# Altium project espressomaker2000.PrjPcb
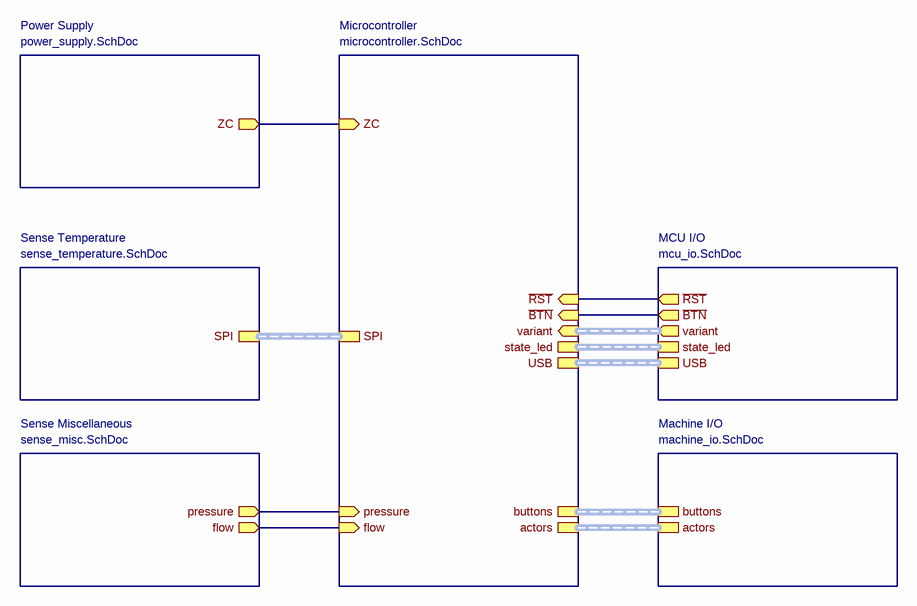
[diagram p0: top_schematic.SchDoc]
ProductNumber: 2001ES; ProductTitle: espressomaster2000; ProjectName: espressomaster2000; Revision: 1
8 sheets, 182 parts. Net scope: hierarchical (ports join the sheet entries above them; power ports are global).
Board file: espressomaster2000.PcbDoc
Sheets:
  top_schematic.SchDoc
    Power Supply = power_supply.SchDoc
    Microcontroller = microcontroller.SchDoc
    Sense Temperature = sense_temperature.SchDoc
      FLT1 = temp_filt.SchDoc
      FLT2 = temp_filt.SchDoc
      FLT3 = temp_filt.SchDoc
      FLT4 = temp_filt.SchDoc
      FLT5 = temp_filt.SchDoc
    Sense Miscellaneous = sense_misc.SchDoc
    Machine I/O = machine_io.SchDoc
    MCU I/O = mcu_io.SchDoc

## Sheet top_schematic.SchDoc: Top Schematic
size A4; Date: 27.05.2014; Author: Stefan Lüthi; Organization: BFH; Address1: Bern University of Applied Sciences; Address2: Engineering and Information Technology; Address3: Jlcoweg 1; Address4: CH-3400 Burgdorf; DocumentNumber: 1; Revision: 1.0; SheetNumber: 1; SheetTotal: 8; CurrentDate: 27.05.2014

### Sub-sheets
Machine I/O = machine_io.SchDoc: buttons (harness buttons), actors (harness actors)
MCU I/O = mcu_io.SchDoc: USB (harness USB), ~{RST} (out), ~{BTN} (out), state_led (harness state_led), variant (out, harness variant)
Microcontroller = microcontroller.SchDoc: actors (harness actors), USB (harness USB), flow (in), ~{RST} (in), pressure (in), ZC (in), SPI (harness SPI), state_led (harness state_led), ~{BTN} (in), buttons (harness buttons), variant (in, harness variant)
Power Supply = power_supply.SchDoc: ZC (out)
Sense Miscellaneous = sense_misc.SchDoc: pressure (out), flow (out)
Sense Temperature = sense_temperature.SchDoc: SPI (harness SPI)

### Nets
~{btn}: sheet Microcontroller/~{BTN}, sheet MCU I/O/~{BTN}
~{RST}: sheet Microcontroller/~{RST}, sheet MCU I/O/~{RST}
flow: sheet Microcontroller/flow, sheet Sense Miscellaneous/flow
pressure: sheet Microcontroller/pressure, sheet Sense Miscellaneous/pressure
zc: sheet Power Supply/ZC, sheet Microcontroller/ZC

### Buses and harness runs
harness sheet Machine I/O/actors = sheet Microcontroller/actors
harness sheet Machine I/O/buttons = sheet Microcontroller/buttons
harness sheet MCU I/O/state_led = sheet Microcontroller/state_led
harness sheet MCU I/O/USB = sheet Microcontroller/USB
harness sheet MCU I/O/variant = sheet Microcontroller/variant
harness sheet Microcontroller/SPI = sheet Sense Temperature/SPI

### Notes on the sheet
- Author:
- Title:
- Number:
- Product:
- Sheet
- of
- Variant:
- Revision:
- File:
- Template:
- A4SL CC-BY-SA (07-17)

## Sheet power_supply.SchDoc: Power Supply
size A4; Date: 27.05.2014; Author: Stefan Lüthi; DrawnBy: Stefan Lüthi; Organization: BFH; Address1: Bern University of Applied Sciences; Address2: Engineering and Information Technology; Address3: Jlcoweg 1; Address4: CH-3400 Burgdorf; DocumentNumber: 1; Revision: 1.0; SheetNumber: 2; SheetTotal: 8; CurrentDate: 27.05.2014
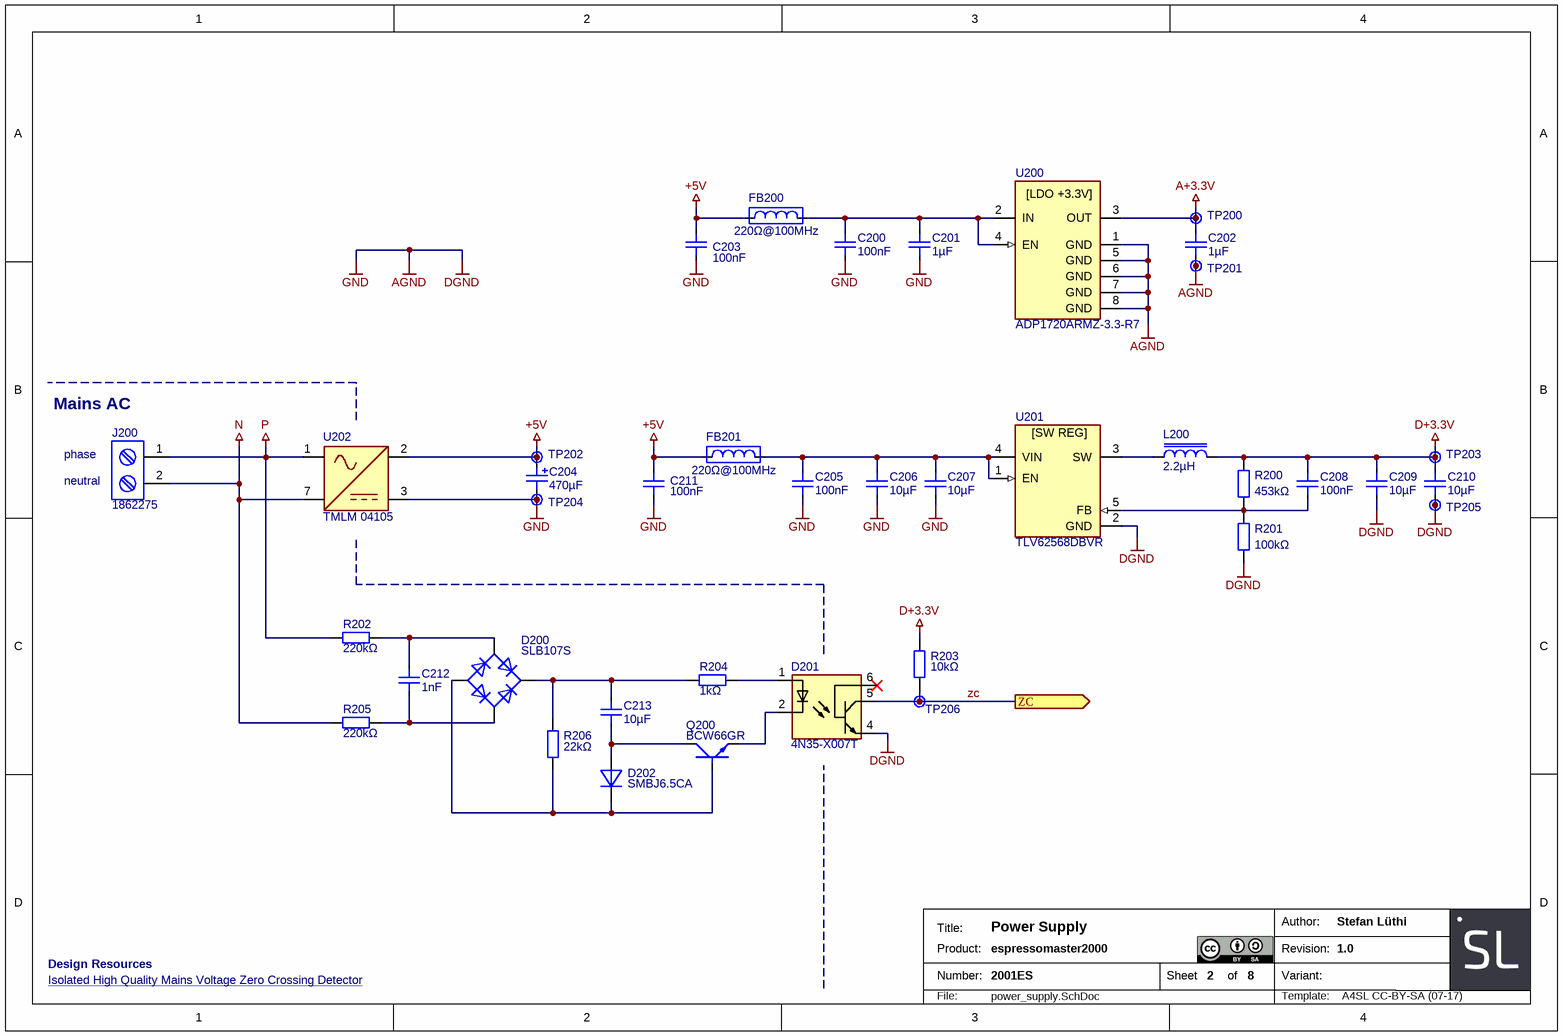
[diagram p1: power_supply.SchDoc]

### Parts
C200  100nF  [SMD0603CAP]
C201  1µF  [SMD0603CAP]
C202  1µF  [SMD0603CAP]
C203  100nF  [SMD0603CAP]
C204  470µF  [CAP-12.5-20-5]
C205  100nF  [SMD0603CAP]
C206  10µF  [SMD1206CAP]
C207  10µF  [SMD1206CAP]
C208  100nF  [SMD0603CAP]
C209  10µF  [SMD1206CAP]
C210  10µF  [SMD1206CAP]
C211  100nF  [SMD0603CAP]
C212  1nF  [SMD0603CAP]
C213  10µF  [SMD1206CAP]
D200  SLB107S  [SLDBS-4]
D201  4N35-X007T  [SMT6-LB]
D202  SMBJ6.5CA  [DO-214AA]
FB200  220Ω@100MHz  [SMD0603RES]
FB201  220Ω@100MHz  [SMD0603RES]
J200  1862275  [1862275]
L200  2.2µH  [WE4040]
Q200  BCW66GR  [SOT-23]
R200  453kΩ  [SMD0603RES]
R201  100kΩ  [SMD0603RES]
R202  220kΩ  [SMD2010RES]
R203  10kΩ  [SMD0603RES]
R204  1kΩ  [SMD0603RES]
R205  220kΩ  [SMD2010RES]
R206  22kΩ  [SMD0603RES]
TP200  Testpoint  [TP]  (value not drawn)  (no BOM)
TP201  Testpoint  [TP]  (value not drawn)  (no BOM)
TP202  Testpoint  [TP]  (value not drawn)  (no BOM)
TP203  Testpoint  [TP]  (value not drawn)  (no BOM)
TP204  Testpoint  [TP]  (value not drawn)  (no BOM)
TP205  Testpoint  [TP]  (value not drawn)  (no BOM)
TP206  Testpoint  [TP]  (value not drawn)  (no BOM)
U200  ADP1720ARMZ-3.3-R7  [MSOP8]
U201  TLV62568DBVR  [SOT-23-5]
U202  TMLM 04105  [TMLM04]

### Ports
ZC (out)

### Nets
+5V: C203.1 C204.P C211.1 FB200.1 FB201.1 TP202.1 U202.2(V+)
A+3.3V: C202.1 TP200.1 U200.3(OUT)
AGND: C200.2 C201.2 C202.2 C203.2 C204.M C205.2 C206.2 C207.2 C209.2 C210.2 C211.2 D201.4 R201.1 TP201.1 TP204.1 TP205.1 U200.1(GND) U200.5(GND) U200.6(GND) U200.7(GND) U200.8(GND) U201.2(GND) U202.3(GND)  [also labelled DGND, GND]
D+3.3V: C208.1 C209.1 C210.1 L200.2 R200.2 R203.2 TP203.1
N: J200.2 R205.2 U202.7(AC)
P: J200.1 R202.2 U202.1(AC)
zc: D201.5 R203.1 TP206.1 ; port ZC
NetC200_1: C200.1 C201.1 FB200.2 U200.2(IN) U200.4(EN)
NetC205_1: C205.1 C206.1 C207.1 FB201.2 U201.1(EN) U201.4(VIN)
NetC208_2: C208.2 R200.1 R201.2 U201.5(FB)
NetC212_1: C212.1 D200.3 R205.1
NetC212_2: C212.2 D200.2 R202.1
NetC213_1: C213.1 D200.1 R204.2 R206.2
NetC213_2: C213.2 D202.A Q200.3(C)
NetD200_4: D200.4 D202.C Q200.1(B) R206.1
NetD201_1: D201.1 R204.1
NetD201_2: D201.2 Q200.2(E)
NetL200_1: L200.1 U201.3(SW)

Not connected (* = marked no-connect by the designer): D201 6*

### Notes on the sheet
- (near J200) Mains AC
- (near J200) neutral
- (near J200) phase
- Isolated High Quality Mains Voltage Zero Crossing Detector <https://cdn.hackaday.io/files/1597066832861504/SimpleIsolatedZeroCrossDetector.pdf>
- Design Resources
- Author:
- Title:
- Number:
- Product:
- Sheet
- of
- Variant:
- Revision:
- File:
- Template:
- A4SL CC-BY-SA (07-17)
- (in symbol ADP1720ARMZ-3.3-R7) [LDO +3.3V]
- (in symbol TLV62568DBVR) [SW REG]

### Library data of the parts
C200-C203 C205-C213 = Capacitor Ceramic: Ceramic Capacitor
C204 = Capacitor Electrolytic: Elektrolytic Capacitor
D200 = Rectifier: Full Bridge Rectifier
D201 = 4N35-X: Optocoupler
D202 = Diode
FB200 FB201 = Ferrite Bead
J200 = 1862275: Screw Terminal, 2 Position, 5mm Spacing
L200 = Inductor
Q200 = Transistor NPN: Bipolar transistor NPN
R200-R206 = Resistor
U200 = ADP1720ARMZ-3.3-R7: LDO 3.3V Output
U201 = TLV62568DBVR: Step-Down Regulator
U202 = TMLM 04: AC/DC Converter (100VAC - 240VAC to 5VDC)

## Sheet microcontroller.SchDoc: Microcontroller
size A4; Date: 27.05.2014; Author: Stefan Lüthi; DrawnBy: Stefan Lüthi; Organization: BFH; Address1: Bern University of Applied Sciences; Address2: Engineering and Information Technology; Address3: Jlcoweg 1; Address4: CH-3400 Burgdorf; DocumentNumber: 1; Revision: 1.0; SheetNumber: 6; SheetTotal: 8; CurrentDate: 27.05.2014
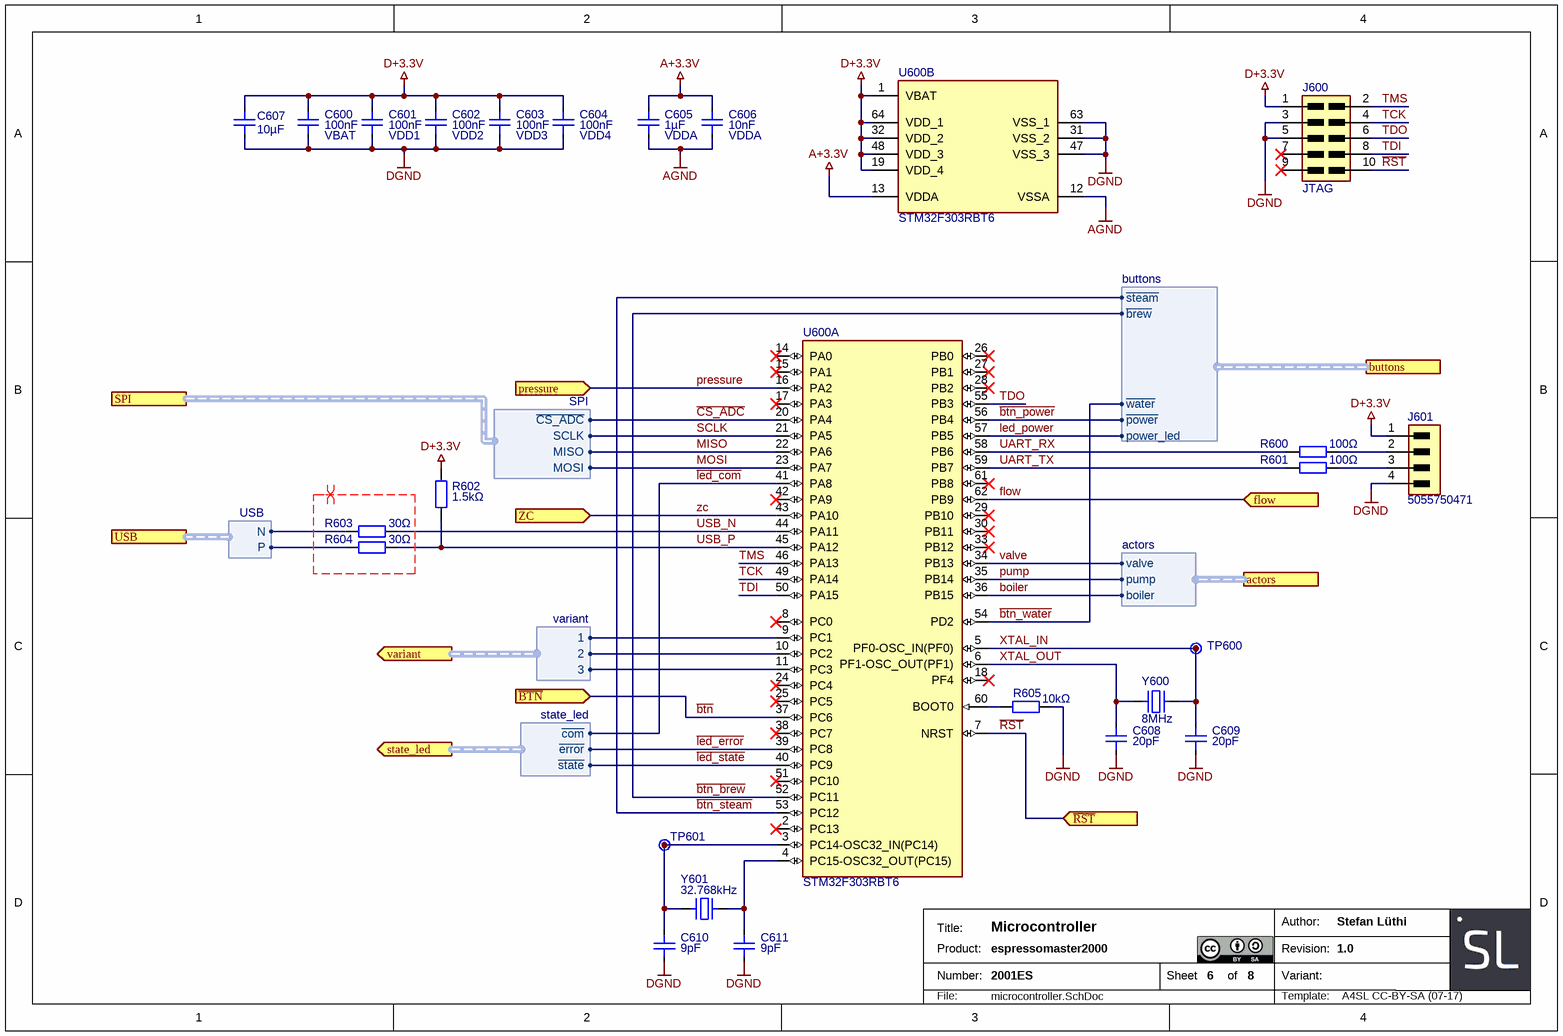
[diagram p2: microcontroller.SchDoc]

### Parts
C600  100nF  pin: VBAT  [SMD0603CAP]
C601  100nF  pin: VDD1  [SMD0603CAP]
C602  100nF  pin: VDD2  [SMD0603CAP]
C603  100nF  pin: VDD3  [SMD0603CAP]
C604  100nF  pin: VDD4  [SMD0603CAP]
C605  1µF  pin: VDDA  [SMD0603CAP]
C606  10nF  pin: VDDA  [SMD0603CAP]
C607  10µF  [SMD1206CAP]
C608  20pF  [SMD0603CAP]
C609  20pF  [SMD0603CAP]
C610  9pF  [SMD0603CAP]
C611  9pF  [SMD0603CAP]
J600  JTAG  [HEADER2X5]
J601  5055750471  [5055750471]
R600  100Ω  [SMD0603RES]
R601  100Ω  [SMD0603RES]
R602  1.5kΩ  [SMD0603RES]
R603  30Ω  [SMD0603RES]
R604  30Ω  [SMD0603RES]
R605  10kΩ  [SMD0603RES]
TP600  Testpoint  [TP]  (value not drawn)  (no BOM)
TP601  Testpoint  [TP]  (value not drawn)  (no BOM)
U600  STM32F303RBT6  [LQFP64]  (parts A,B of 2)
Y600  8MHz  [XTAL32x25]
Y601  32.768kHz  [FC-135 32.7680KA-A3]

### Ports
actors (harness actors), buttons (harness buttons), flow (in), pressure (in), SPI (harness SPI), state_led (out, harness state_led), USB (harness USB), variant (out, harness variant), ZC (in), ~{BTN} (in), ~{RST} (in)

### Harnesses
USB: N, P
SPI: MISO, MOSI, SCLK, ~{CS_ADC}
state_led: ~{com}, ~{state}, ~{error}
actors: valve, pump, boiler
buttons: ~{water}, ~{brew}, ~{steam}, ~{power}, power_led
variant: 1, 2, 3

### Nets
A+3.3V: C605.1 C606.1 U600.13(VDDA)
AGND: C600.2 C601.2 C602.2 C603.2 C604.2 C605.2 C606.2 C607.2 C608.2 C609.2 C610.2 C611.2 J600.3 J600.5 J601.4 R605.2 U600.12(VSSA) U600.31(VSS_2) U600.47(VSS_3) U600.63(VSS_1) Y600.2 Y600.4 Y601.2 Y601.4  [also labelled DGND, GND]
D+3.3V: C600.1 C601.1 C602.1 C603.1 C604.1 C607.1 J600.1 J601.1 R602.1 U600.1(VBAT) U600.19(VDD_4) U600.32(VDD_2) U600.48(VDD_3) U600.64(VDD_1)
~{btn}: U600.37(PC6) ; port ~{BTN}
~{btn_brew}: U600.52(PC11) ; port buttons.~{brew}
~{btn_power}: U600.56(PB4) ; port buttons.~{power}
~{btn_steam}: U600.53(PC12) ; port buttons.~{steam}
~{btn_water}: U600.54(PD2) ; port buttons.~{water}
~{CS_ADC}: U600.20(PA4) ; port SPI.~{CS_ADC}
~{led_com}: U600.41(PA8) ; port state_led.~{com}
~{led_error}: U600.39(PC8) ; port state_led.~{error}
~{led_state}: U600.40(PC9) ; port state_led.~{state}
~{RST}: J600.10 U600.7(NRST) ; port ~{RST}
boiler: U600.36(PB15) ; port actors.boiler
CON_N: R603.2 ; port USB.N
CON_P: R604.2 ; port USB.P
flow: U600.62(PB9) ; port flow
led_power: U600.57(PB5) ; port buttons.power_led
MISO: U600.22(PA6) ; port SPI.MISO
MOSI: U600.23(PA7) ; port SPI.MOSI
pressure: U600.16(PA2) ; port pressure
pump: U600.35(PB14) ; port actors.pump
SCLK: U600.21(PA5) ; port SPI.SCLK
TCK: J600.4 U600.49(PA14)
TDI: J600.8 U600.50(PA15)
TDO: J600.6 U600.55(PB3)
TMS: J600.2 U600.46(PA13)
UART_RX: R600.1 U600.58(PB6)
UART_TX: R601.1 U600.59(PB7)
USB_N: R603.1 U600.44(PA11)
USB_P: R602.2 R604.1 U600.45(PA12)
valve: U600.34(PB13) ; port actors.valve
var1: U600.9(PC1) ; port variant.1
var2: U600.10(PC2) ; port variant.2
var3: U600.11(PC3) ; port variant.3
XTAL_IN: C609.1 TP600.1 U600.5(PF0-OSC_IN(PF0)) Y600.3
XTAL_OUT: C608.1 U600.6(PF1-OSC_OUT(PF1)) Y600.1
zc: U600.43(PA10) ; port ZC
NetC610_1: C610.1 TP601.1 U600.3(PC14-OSC32_IN(PC14)) Y601.1
NetC611_1: C611.1 U600.4(PC15-OSC32_OUT(PC15)) Y601.3
NetJ601_2: J601.2 R600.2
NetJ601_3: J601.3 R601.2
NetR605_1: R605.1 U600.60(BOOT0)

Not connected (* = marked no-connect by the designer): J600 7* 9*; U600 2(PC13)* 8(PC0)* 14(PA0)* 15(PA1)* 17(PA3)* 18(PF4)* 24(PC4)* 25(PC5)* 26(PB0)* 27(PB1)* 28(PB2)* 29(PB10)* 30(PB11)* 33(PB12)* 38(PC7)* 42(PA9)* 51(PC10)* 61(PB8)*

### Layout directives
differential pair; rule Differential Pairs Routing [Pref Gap = 0.203mm    Min Gap  = 0.154mm    Max Gap  = 2mmPref Width = 0.175mm    Min Width  = 0.15mm    Max Width  = 1mm]: (no net found under the mark)

### Notes on the sheet
- Author:
- Title:
- Number:
- Product:
- Sheet
- of
- Variant:
- Revision:
- File:
- Template:
- A4SL CC-BY-SA (07-17)

### Library data of the parts
C600-C611 = Capacitor Ceramic: Ceramic Capacitor
J600 = 2x5P Connector: 2x5P Connector, 1.27mm
J601 = Connector 4x1P
R600-R605 = Resistor
U600 = STM32F303RBT6: ARM Cortex-M4 32-bit MCU; D/A Converter: 2x12-bit (2 Channel); FLASH Size (Prog) (kB): 128; I/Os (High Current): 52; Internal RAM Size (kB): 32; Operating Frequency(F) (Processor speed) (MHz): 72; Packing: Tray; Supply Voltage(Vcc) min (V): 2; DatasheetVersion: Rev. 6; PackageVersion: Rev. 4, 06/2013; PackageReference: LQFP64; PackageDescription: 64-Pin Low Profile Quad Flat Package, 10 x 10 mm Body, 0.5 mm Pitch; Supplier 1: Digi-Key; Supplier Part Number 1: STM32F303RBT6-ND; Supplier 2: Farnell; Supplier Part Number 2: 2333255; Supplier 3: Newark; Supplier Part Number 3: 99W9873; Supplier 4: Newark; Supplier Part Number 4: 66W7287; Supplier 5: Mouser; Supplier Part Number 5: 511-STM32F303RBT6; Core: ARM Cortex-M4; Mounting Technology: Surface Mount; PartNumber: STM32F303RBT6; ComponentLink1Description: Manufacturer URL; ComponentLink1URL: http://www.st.com/web/en/home.html; ComponentLink2Description: Datasheet; ComponentLink2URL: http://www.st.com/st-web-ui/static/active/en/resource/technical/document/datasheet/DM00058181.pdf; ComponentLink3Description: Package Specification; ComponentLink3URL: http://www.st.com/st-web-ui/static/active/en/resource/technical/document/datasheet/DM00037051.pdf
Y600 Y601 = Crystal

## Sheet sense_temperature.SchDoc: Sense Temperature
size A4; Date: 27.05.2014; Author: Stefan Lüthi; DrawnBy: Author; Organization: BFH; Address1: Bern University of Applied Sciences; Address2: Engineering and Information Technology; Address3: Jlcoweg 1; Address4: CH-3400 Burgdorf; DocumentNumber: 1; Revision: 1.0; SheetNumber: 3; SheetTotal: 8; CurrentDate: 27.05.2014
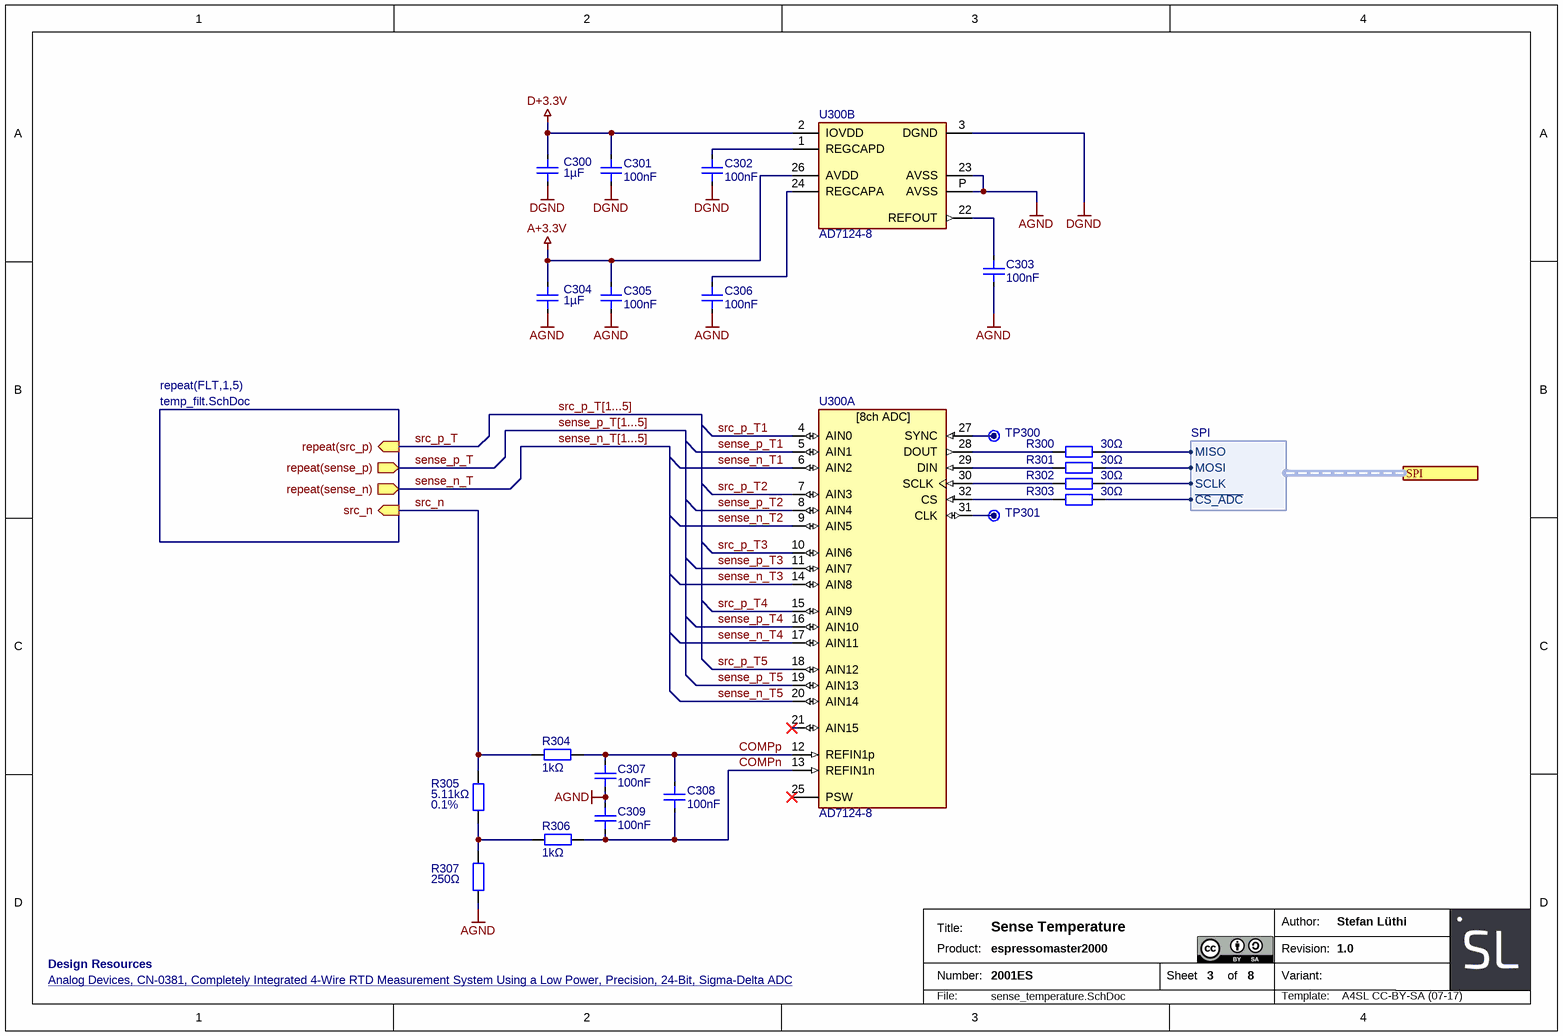
[diagram p3: sense_temperature.SchDoc]

### Parts
C300  1µF  [SMD0603CAP]
C301  100nF  [SMD0603CAP]
C302  100nF  [SMD0603CAP]
C303  100nF  [SMD0603CAP]
C304  1µF  [SMD0603CAP]
C305  100nF  [SMD0603CAP]
C306  100nF  [SMD0603CAP]
C307  100nF  [SMD0603CAP]
C308  100nF  [SMD0603CAP]
C309  100nF  [SMD0603CAP]
R300  30Ω  [SMD0603RES]
R301  30Ω  [SMD0603RES]
R302  30Ω  [SMD0603RES]
R303  30Ω  [SMD0603RES]
R304  1kΩ  [SMD0603RES]
R305  5.11kΩ  precision: 0.1%  [SMD0603RES]
R306  1kΩ  [SMD0603RES]
R307  250Ω  [SMD0603RES]
TP300  Testpoint  [TP]  (value not drawn)  (no BOM)
TP301  Testpoint  [TP]  (value not drawn)  (no BOM)
U300  AD7124-8  [QFN32]  (parts A,B of 2)

### Sub-sheets
repeat(FLT,1,5) = temp_filt.SchDoc: repeat(sense_n) (out), repeat(src_p) (in), src_n (in), repeat(sense_p) (out)

### Ports
SPI (harness SPI)

### Harnesses
SPI: MISO, MOSI, SCLK, ~{CS_ADC}

### Nets
A+3.3V: C304.1 C305.1 U300.26(AVDD)
AGND: C300.2 C301.2 C302.2 C303.2 C304.2 C305.2 C306.2 C307.2 C309.1 R307.1 U300.3(DGND) U300.23(AVSS) U300.P(AVSS)  [also labelled DGND]
D+3.3V: C300.1 C301.1 U300.2(IOVDD)
~{CS_ADC}: R303.1 ; port SPI.~{CS_ADC}
COMPn: C308.2 C309.2 R306.1 U300.13(REFIN1n)
COMPp: C307.1 C308.1 R304.1 U300.12(REFIN1p)
MISO: R300.1 ; port SPI.MISO
MOSI: R301.1 ; port SPI.MOSI
SCLK: R302.1 ; port SPI.SCLK
sense_n_T: sheet repeat(FLT,1,5)/repeat(sense_n)
sense_n_T1: U300.6(AIN2)
sense_n_T2: U300.9(AIN5)
sense_n_T3: U300.14(AIN8)
sense_n_T4: U300.17(AIN11)
sense_n_T5: U300.20(AIN14)
sense_p_T: sheet repeat(FLT,1,5)/repeat(sense_p)
sense_p_T1: U300.5(AIN1)
sense_p_T2: U300.8(AIN4)
sense_p_T3: U300.11(AIN7)
sense_p_T4: U300.16(AIN10)
sense_p_T5: U300.19(AIN13)
src_n: R304.2 R305.1 ; sheet repeat(FLT,1,5)/src_n
src_p_T: sheet repeat(FLT,1,5)/repeat(src_p)
src_p_T1: U300.4(AIN0)
src_p_T2: U300.7(AIN3)
src_p_T3: U300.10(AIN6)
src_p_T4: U300.15(AIN9)
src_p_T5: U300.18(AIN12)
NetC302_1: C302.1 U300.1(REGCAPD)
NetC303_1: C303.1 U300.22(REFOUT)
NetC306_1: C306.1 U300.24(REGCAPA)
NetR300_2: R300.2 U300.28(DOUT)
NetR301_2: R301.2 U300.29(DIN)
NetR302_2: R302.2 U300.30(SCLK)
NetR303_2: R303.2 U300.32(CS)
NetR305_2: R305.2 R306.2 R307.2
NetTP300_1: TP300.1 U300.27(SYNC)
NetTP301_1: TP301.1 U300.31(CLK)

Not connected (* = marked no-connect by the designer): U300 21(AIN15)* 25(PSW)*

### Buses and harness runs
bus sense_n_T[1...5]
bus sense_p_T[1...5]
bus src_p_T[1...5]

### Notes on the sheet
- Analog Devices, CN-0381, Completely Integrated 4-Wire RTD Measurement System Using a Low Power, Precision, 24-Bit, Sigma-Delta ADC <https://www.analog.com/media/en/reference-design-documentation/reference-designs/CN0381.pdf>
- Design Resources
- Author:
- Title:
- Number:
- Product:
- Sheet
- of
- Variant:
- Revision:
- File:
- Template:
- A4SL CC-BY-SA (07-17)
- (in symbol AD7124-8, part A) [8ch ADC]

### Library data of the parts
C300-C309 = Capacitor Ceramic: Ceramic Capacitor
R300-R307 = Resistor
U300 = AD7124-8: 8-Channel, Low Noise, Low Power, 24-Bit, Sigma-Delta ADC with PGA and Reference; Supplier 1: Digi-Key; Supplier Part Number 1: AD7124-8BCPZ-ND

## Sheet temp_filt.SchDoc: RDT Filter
size A4; Date: 27.05.2014; Author: Stefan Lüthi; DrawnBy: Author; Organization: BFH; Address1: Bern University of Applied Sciences; Address2: Engineering and Information Technology; Address3: Jlcoweg 1; Address4: CH-3400 Burgdorf; DocumentNumber: 1; Revision: 1.0; SheetNumber: 4; SheetTotal: 8; CurrentDate: 27.05.2014
Used 5 times, as channels Sense Temperature/FLT1, Sense Temperature/FLT2, Sense Temperature/FLT3, Sense Temperature/FLT4, Sense Temperature/FLT5. Parts and nets are listed once, with the designators drawn on the sheet.
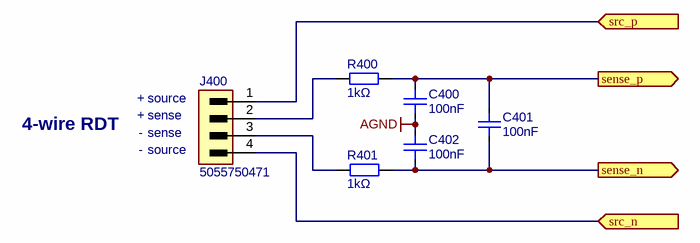
[diagram p4: temp_filt.SchDoc]

### Parts
C400  100nF  [SMD0603CAP]
C401  100nF  [SMD0603CAP]
C402  100nF  [SMD0603CAP]
J400  5055750471  [5055750471]
R400  1kΩ  [SMD0603RES]
R401  1kΩ  [SMD0603RES]

### Ports
sense_n (out), sense_p (out), src_n (in), src_p (in)

### Nets
AGND: C400.2 C402.1
sense_n: C401.2 C402.2 R401.1 ; port sense_n
sense_p: C400.1 C401.1 R400.1 ; port sense_p
src_n: J400.4 ; port src_n
src_p: J400.1 ; port src_p
NetJ400_2: J400.2 R400.2
NetJ400_3: J400.3 R401.2

### Channels
Sense Temperature/FLT1: designators end in _FLT1; ports sense_n=sense_n_T1 sense_p=sense_p_T1 src_n=src_n src_p=src_p_T1
Sense Temperature/FLT2: designators end in _FLT2; ports sense_n=sense_n_T2 sense_p=sense_p_T2 src_n=src_n src_p=src_p_T2
Sense Temperature/FLT3: designators end in _FLT3; ports sense_n=sense_n_T3 sense_p=sense_p_T3 src_n=src_n src_p=src_p_T3
Sense Temperature/FLT4: designators end in _FLT4; ports sense_n=sense_n_T4 sense_p=sense_p_T4 src_n=src_n src_p=src_p_T4
Sense Temperature/FLT5: designators end in _FLT5; ports sense_n=sense_n_T5 sense_p=sense_p_T5 src_n=src_n src_p=src_p_T5

### Notes on the sheet
- 4-wire RDT
- +
- -
- (near J400) source
- (near J400) sense
- Author:
- Title:
- Number:
- Product:
- Sheet
- of
- Variant:
- Revision:
- File:
- Template:
- A4SL CC-BY-SA (07-17)

### Library data of the parts
C400-C402 = Capacitor Ceramic: Ceramic Capacitor
J400 = Connector 4x1P
R400 R401 = Resistor

## Sheet sense_misc.SchDoc: Sense Miscellaneous
size A4; Date: 27.05.2014; Author: Stefan Lüthi; DrawnBy: Stefan Lüthi; Organization: BFH; Address1: Bern University of Applied Sciences; Address2: Engineering and Information Technology; Address3: Jlcoweg 1; Address4: CH-3400 Burgdorf; DocumentNumber: 1; Revision: 1.0; SheetNumber: 5; SheetTotal: 8; CurrentDate: 27.05.2014
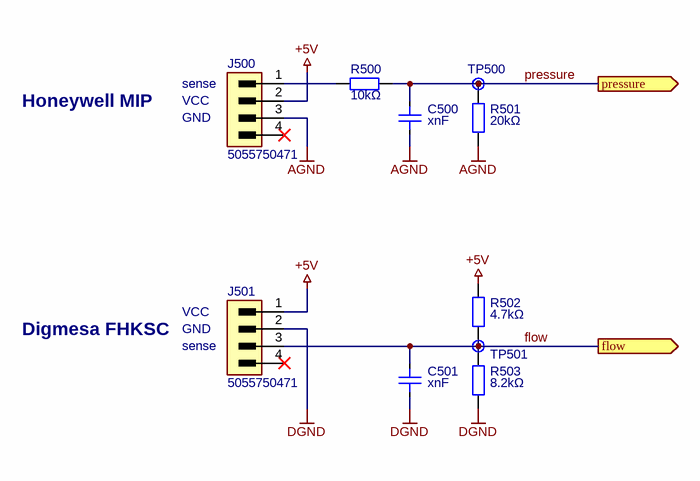
[diagram p5: sense_misc.SchDoc]

### Parts
C500  xnF  [SMD0603CAP]
C501  xnF  [SMD0603CAP]
J500  5055750471  [5055750471]
J501  5055750471  [5055750471]
R500  10kΩ  [SMD0603RES]
R501  20kΩ  [SMD0603RES]
R502  4.7kΩ  [SMD0603RES]
R503  8.2kΩ  [SMD0603RES]
TP500  Testpoint  [TP]  (value not drawn)  (no BOM)
TP501  Testpoint  [TP]  (value not drawn)  (no BOM)

### Ports
flow (out), pressure (out)

### Nets
+5V: J500.2 J501.1 R502.1
AGND: C500.2 C501.2 J500.3 J501.2 R501.2 R503.2  [also labelled DGND]
flow: C501.1 J501.3 R502.2 R503.1 TP501.1 ; port flow
pressure: C500.1 R500.1 R501.1 TP500.1 ; port pressure
NetJ500_1: J500.1 R500.2

Not connected (* = marked no-connect by the designer): J500 4*; J501 4*

### Notes on the sheet
- Honeywell MIP
- VCC
- GND
- (near J500) sense
- Digmesa FHKSC
- (near J501) sense
- Author:
- Title:
- Number:
- Product:
- Sheet
- of
- Variant:
- Revision:
- File:
- Template:
- A4SL CC-BY-SA (07-17)

### Library data of the parts
C500 C501 = Capacitor Ceramic: Ceramic Capacitor
J500 J501 = Connector 4x1P
R500-R503 = Resistor

## Sheet machine_io.SchDoc: Machine I/O
size A4; Date: 27.05.2014; Author: Stefan Lüthi; DrawnBy: Author; Organization: BFH; Address1: Bern University of Applied Sciences; Address2: Engineering and Information Technology; Address3: Jlcoweg 1; Address4: CH-3400 Burgdorf; DocumentNumber: 1; Revision: 1.0; SheetNumber: 8; SheetTotal: 8; CurrentDate: 27.05.2014
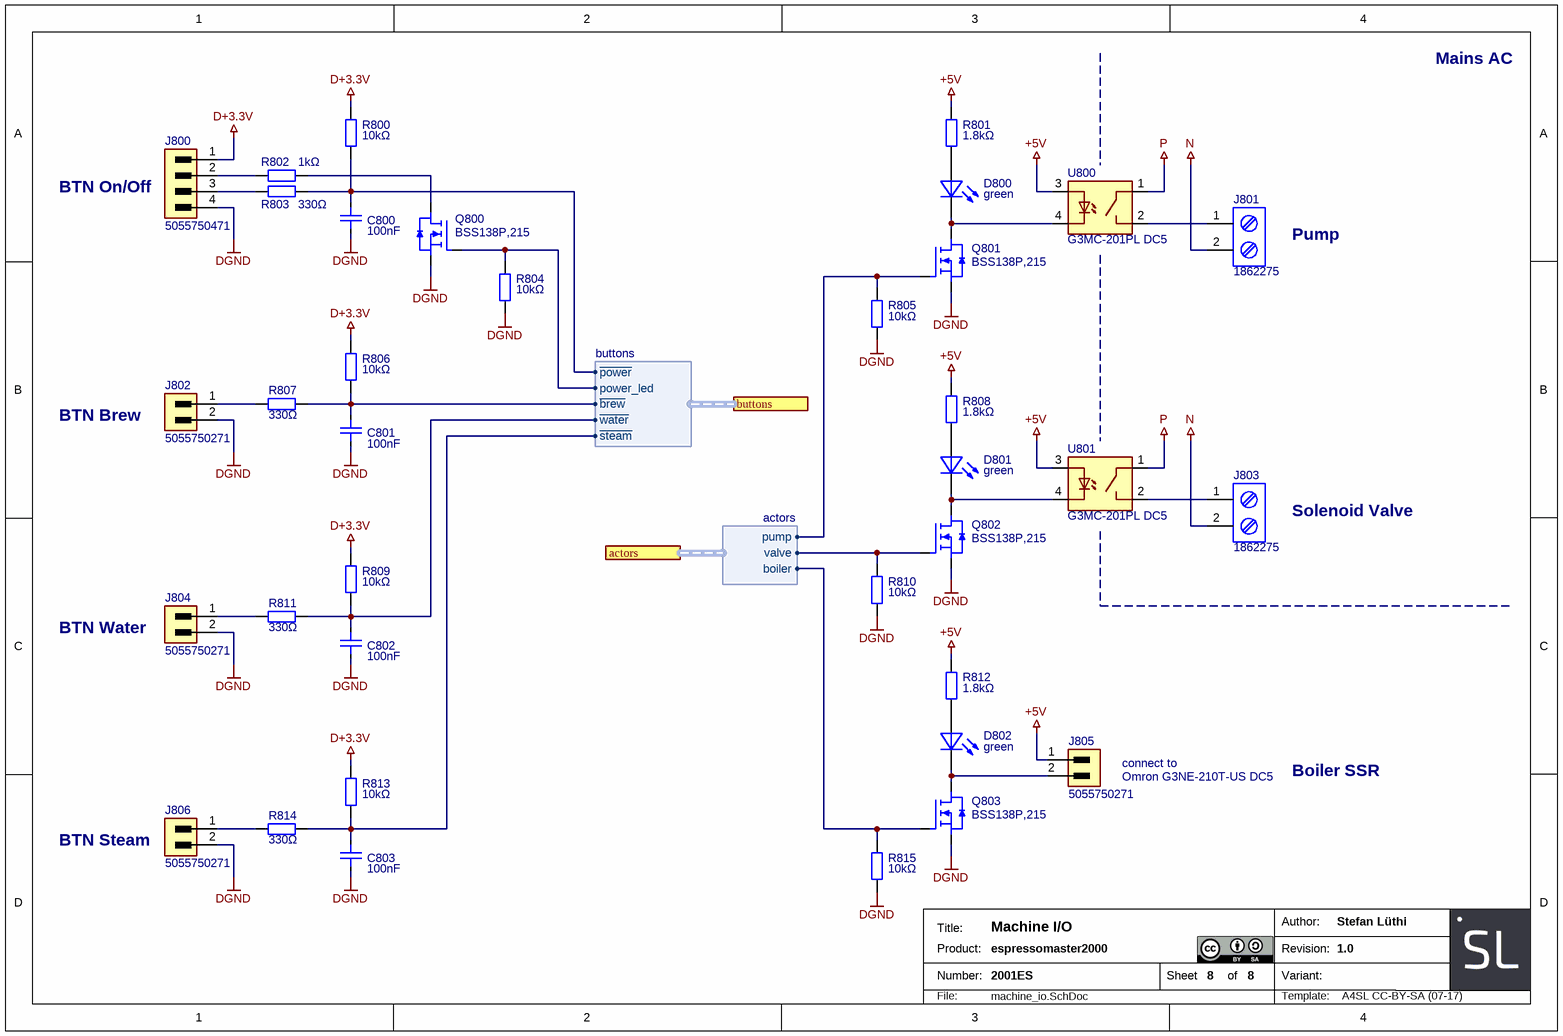
[diagram p6: machine_io.SchDoc]

### Parts
C800  100nF  [SMD0603CAP]
C801  100nF  [SMD0603CAP]
C802  100nF  [SMD0603CAP]
C803  100nF  [SMD0603CAP]
D800  green  [SMD0603LED]
D801  green  [SMD0603LED]
D802  green  [SMD0603LED]
J800  5055750471  [5055750471]
J801  1862275  [1862275]
J802  5055750271  [5055750271]
J803  1862275  [1862275]
J804  5055750271  [5055750271]
J805  5055750271  [5055750271]
J806  5055750271  [5055750271]
Q800  BSS138P,215  [SOT-23-FET]
Q801  BSS138P,215  [SOT-23-FET]
Q802  BSS138P,215  [SOT-23-FET]
Q803  BSS138P,215  [SOT-23-FET]
R800  10kΩ  [SMD0603RES]
R801  1.8kΩ  [SMD0603RES]
R802  1kΩ  [SMD0603RES]
R803  330Ω  [SMD0603RES]
R804  10kΩ  [SMD0603RES]
R805  10kΩ  [SMD0603RES]
R806  10kΩ  [SMD0603RES]
R807  330Ω  [SMD0603RES]
R808  1.8kΩ  [SMD0603RES]
R809  10kΩ  [SMD0603RES]
R810  10kΩ  [SMD0603RES]
R811  330Ω  [SMD0603RES]
R812  1.8kΩ  [SMD0603RES]
R813  10kΩ  [SMD0603RES]
R814  330Ω  [SMD0603RES]
R815  10kΩ  [SMD0603RES]
U800  G3MC-201PL DC5  [G3MC-202P]
U801  G3MC-201PL DC5  [G3MC-202P]

### Ports
actors (harness actors), buttons (harness buttons)

### Harnesses
actors: valve, pump, boiler
buttons: ~{water}, ~{brew}, ~{steam}, ~{power}, power_led

### Nets
+5V: J805.1 R801.2 R808.2 R812.2 U800.3 U801.3
D+3.3V: J800.1 R800.2 R806.2 R809.2 R813.2
DGND: C800.2 C801.2 C802.2 C803.2 J800.4 J802.2 J804.2 J806.2 Q800.S Q801.S Q802.S Q803.S R804.2 R805.2 R810.2 R815.2  [project net AGND]
N: J801.2 J803.2
P: U800.1 U801.1
~{btn_brew}: C801.1 R806.1 R807.1 ; port buttons.~{brew}
~{btn_power}: C800.1 R800.1 R803.1 ; port buttons.~{power}
~{btn_steam}: C803.1 R813.1 R814.1 ; port buttons.~{steam}
~{btn_water}: C802.1 R809.1 R811.1 ; port buttons.~{water}
boiler: Q803.G R815.1 ; port actors.boiler
led_power: Q800.G R804.1 ; port buttons.power_led
pump: Q801.G R805.1 ; port actors.pump
valve: Q802.G R810.1 ; port actors.valve
NetD800_A: D800.A R801.1
NetD800_C: D800.C Q801.D U800.4
NetD801_A: D801.A R808.1
NetD801_C: D801.C Q802.D U801.4
NetD802_A: D802.A R812.1
NetD802_C: D802.C J805.2 Q803.D
NetJ800_2: J800.2 R802.2
NetJ800_3: J800.3 R803.2
NetJ801_1: J801.1 U800.2
NetJ802_1: J802.1 R807.2
NetJ803_1: J803.1 U801.2
NetJ804_1: J804.1 R811.2
NetJ806_1: J806.1 R814.2
NetQ800_D: Q800.D R802.1

### Notes on the sheet
- Mains AC
- (near J800) BTN On/Off
- Pump
- BTN Brew
- Solenoid Valve
- BTN Water
- (near J805) connect to
  Omron G3NE-210T-US DC5
- Boiler SSR
- BTN Steam
- Author:
- Title:
- Number:
- Product:
- Sheet
- of
- Variant:
- Revision:
- File:
- Template:
- A4SL CC-BY-SA (07-17)

### Library data of the parts
C800-C803 = Capacitor Ceramic: Ceramic Capacitor
D800-D802 = LED
J800 = Connector 4x1P
J801 J803 = 1862275: Screw Terminal, 2 Position, 5mm Spacing
J802 J804-J806 = Connector 2x1P
Q800-Q803 = NMOS: NMOS Transistor
R800-R815 = Resistor
U800 U801 = OptoMOS SSR: OptoMOS Solid State Relay

## Sheet mcu_io.SchDoc: Microcontroller I/O
size A4; Author: Stefan Lüthi; Revision: 1.0; SheetNumber: 7; SheetTotal: 8
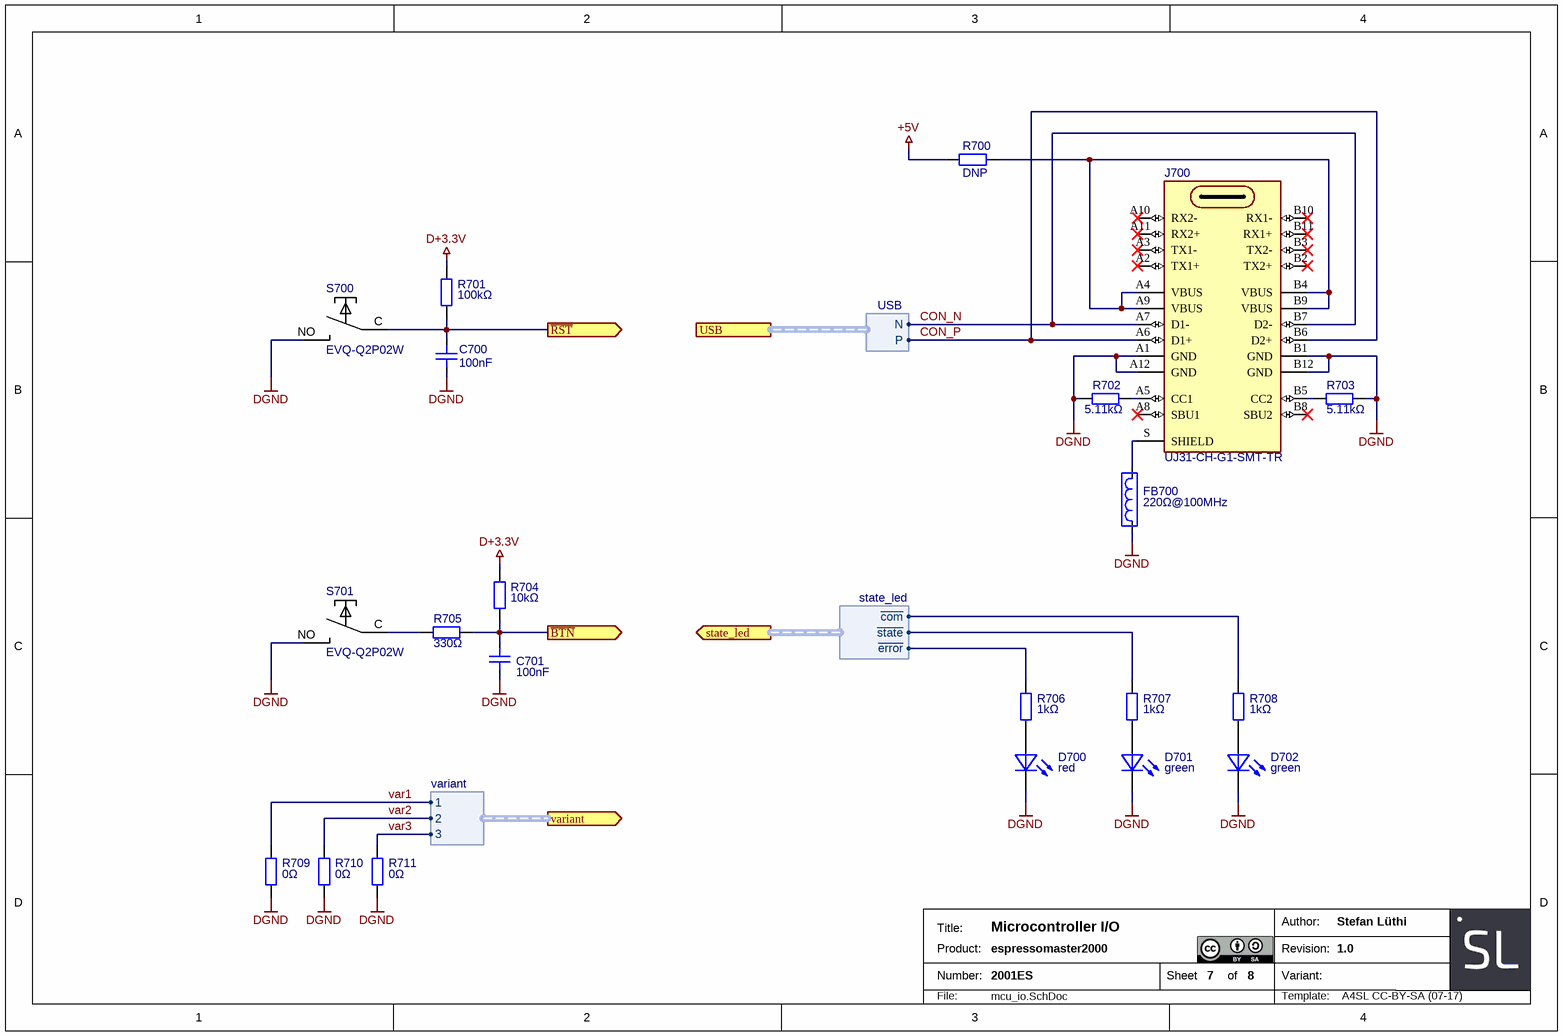
[diagram p7: mcu_io.SchDoc]

### Parts
C700  100nF  [SMD0603CAP]
C701  100nF  [SMD0603CAP]
D700  red  [SMD0603LED]
D701  green  [SMD0603LED]
D702  green  [SMD0603LED]
FB700  220Ω@100MHz  [SMD0603RES]
J700  UJ31-CH-G1-SMT-TR  [UJ31-CH-G1-SMT-TR]
R700  DNP  [SMD0603RES]
R701  100kΩ  [SMD0603RES]
R702  5.11kΩ  [SMD0603RES]
R703  5.11kΩ  [SMD0603RES]
R704  10kΩ  [SMD0603RES]
R705  330Ω  [SMD0603RES]
R706  1kΩ  [SMD0603RES]
R707  1kΩ  [SMD0603RES]
R708  1kΩ  [SMD0603RES]
R709  0Ω  [SMD0603RES]
R710  0Ω  [SMD0603RES]
R711  0Ω  [SMD0603RES]
S700  EVQ-Q2P02W  [EVQQ2]
S701  EVQ-Q2P02W  [EVQQ2]

### Ports
state_led (out, harness state_led), USB (harness USB), variant (out, harness variant), ~{BTN} (out), ~{RST} (out)

### Harnesses
USB: N, P
state_led: ~{com}, ~{state}, ~{error}
variant: 1, 2, 3

### Nets
+5V: R700.2
D+3.3V: R701.2 R704.2
DGND: C700.2 C701.2 D700.C D701.C D702.C FB700.1 J700.A1(GND) J700.A12(GND) J700.B1(GND) J700.B12(GND) R702.1 R703.1 R709.1 R710.1 R711.1 S700.NO S701.NO  [project net AGND]
~{btn}: C701.1 R704.1 R705.1 ; port ~{BTN}
~{led_com}: R708.2 ; port state_led.~{com}
~{led_error}: R706.2 ; port state_led.~{error}
~{led_state}: R707.2 ; port state_led.~{state}
~{RST}: C700.1 R701.1 S700.C ; port ~{RST}
CON_N: J700.A7(D1-) J700.B7(D2-) ; port USB.N
CON_P: J700.A6(D1+) J700.B6(D2+) ; port USB.P
var1: R709.2 ; port variant.1
var2: R710.2 ; port variant.2
var3: R711.2 ; port variant.3
NetD700_A: D700.A R706.1
NetD701_A: D701.A R707.1
NetD702_A: D702.A R708.1
NetFB700_2: FB700.2 J700.S(SHIELD)
NetJ700_A4: J700.A4(VBUS) J700.A9(VBUS) J700.B4(VBUS) J700.B9(VBUS) R700.1
NetJ700_A5: J700.A5(CC1) R702.2
NetJ700_B5: J700.B5(CC2) R703.2
NetR705_2: R705.2 S701.C

Not connected (* = marked no-connect by the designer): J700 A2(TX1+)* A3(TX1-)* A8(SBU1)* A10(RX2-)* A11(RX2+)* B2(TX2+)* B3(TX2-)* B8(SBU2)* B10(RX1-)* B11(RX1+)*

### Notes on the sheet
- Author:
- Title:
- Number:
- Product:
- Sheet
- of
- Variant:
- Revision:
- File:
- Template:
- A4SL CC-BY-SA (07-17)

### Library data of the parts
C700 C701 = Capacitor Ceramic: Ceramic Capacitor
D700-D702 = LED
FB700 = Ferrite Bead
J700 = Connector USB C: USB Type C Jack; Manufacturer Part No.: UJ31-CH-G1-SMT-TR
R700-R711 = Resistor
S700 S701 = Button: Simple Button

## Nets that join several sheets
+5V: power_supply (7 pins), sense_misc (J500.2 J501.1 R502.1), machine_io (6 pins), mcu_io (R700.2)
A+3.3V: power_supply (C202.1 TP200.1 U200.3), microcontroller (C605.1 C606.1 U600.13), sense_temperature (C304.1 C305.1 U300.26)
AGND: power_supply (23 pins), microcontroller (24 pins), sense_temperature (13 pins), Sense Temperature/FLT1 (C400_FLT1.2 C402_FLT1.1), Sense Temperature/FLT2 (C400_FLT2.2 C402_FLT2.1), Sense Temperature/FLT3 (C400_FLT3.2 C402_FLT3.1), Sense Temperature/FLT4 (C400_FLT4.2 C402_FLT4.1), Sense Temperature/FLT5 (C400_FLT5.2 C402_FLT5.1), sense_misc (6 pins), machine_io (16 pins), mcu_io (17 pins)
D+3.3V: power_supply (7 pins), microcontroller (14 pins), sense_temperature (C300.1 C301.1 U300.2), machine_io (5 pins), mcu_io (R701.2 R704.2)
N: power_supply (J200.2 R205.2 U202.7), machine_io (J801.2 J803.2)
P: power_supply (J200.1 R202.2 U202.1), machine_io (U800.1 U801.1)
~{btn}: microcontroller (U600.37), mcu_io (C701.1 R704.1 R705.1)
~{btn_brew}: microcontroller (U600.52), machine_io (C801.1 R806.1 R807.1)
~{btn_power}: microcontroller (U600.56), machine_io (C800.1 R800.1 R803.1)
~{btn_steam}: microcontroller (U600.53), machine_io (C803.1 R813.1 R814.1)
~{btn_water}: microcontroller (U600.54), machine_io (C802.1 R809.1 R811.1)
~{CS_ADC}: microcontroller (U600.20), sense_temperature (R303.1)
~{led_com}: microcontroller (U600.41), mcu_io (R708.2)
~{led_error}: microcontroller (U600.39), mcu_io (R706.2)
~{led_state}: microcontroller (U600.40), mcu_io (R707.2)
~{RST}: microcontroller (J600.10 U600.7), mcu_io (C700.1 R701.1 S700.C)
boiler: microcontroller (U600.36), machine_io (Q803.G R815.1)
CON_N: microcontroller (R603.2), mcu_io (J700.A7 J700.B7)
CON_P: microcontroller (R604.2), mcu_io (J700.A6 J700.B6)
flow: microcontroller (U600.62), sense_misc (5 pins)
led_power: microcontroller (U600.57), machine_io (Q800.G R804.1)
MISO: microcontroller (U600.22), sense_temperature (R300.1)
MOSI: microcontroller (U600.23), sense_temperature (R301.1)
pressure: microcontroller (U600.16), sense_misc (C500.1 R500.1 R501.1 TP500.1)
pump: microcontroller (U600.35), machine_io (Q801.G R805.1)
SCLK: microcontroller (U600.21), sense_temperature (R302.1)
sense_n_T1: sense_temperature (U300.6), Sense Temperature/FLT1 (C401_FLT1.2 C402_FLT1.2 R401_FLT1.1)
sense_n_T2: sense_temperature (U300.9), Sense Temperature/FLT2 (C401_FLT2.2 C402_FLT2.2 R401_FLT2.1)
sense_n_T3: sense_temperature (U300.14), Sense Temperature/FLT3 (C401_FLT3.2 C402_FLT3.2 R401_FLT3.1)
sense_n_T4: sense_temperature (U300.17), Sense Temperature/FLT4 (C401_FLT4.2 C402_FLT4.2 R401_FLT4.1)
sense_n_T5: sense_temperature (U300.20), Sense Temperature/FLT5 (C401_FLT5.2 C402_FLT5.2 R401_FLT5.1)
sense_p_T1: sense_temperature (U300.5), Sense Temperature/FLT1 (C400_FLT1.1 C401_FLT1.1 R400_FLT1.1)
sense_p_T2: sense_temperature (U300.8), Sense Temperature/FLT2 (C400_FLT2.1 C401_FLT2.1 R400_FLT2.1)
sense_p_T3: sense_temperature (U300.11), Sense Temperature/FLT3 (C400_FLT3.1 C401_FLT3.1 R400_FLT3.1)
sense_p_T4: sense_temperature (U300.16), Sense Temperature/FLT4 (C400_FLT4.1 C401_FLT4.1 R400_FLT4.1)
sense_p_T5: sense_temperature (U300.19), Sense Temperature/FLT5 (C400_FLT5.1 C401_FLT5.1 R400_FLT5.1)
src_n: sense_temperature (R304.2 R305.1), Sense Temperature/FLT1 (J400_FLT1.4), Sense Temperature/FLT2 (J400_FLT2.4), Sense Temperature/FLT3 (J400_FLT3.4), Sense Temperature/FLT4 (J400_FLT4.4), Sense Temperature/FLT5 (J400_FLT5.4)
src_p_T1: sense_temperature (U300.4), Sense Temperature/FLT1 (J400_FLT1.1)
src_p_T2: sense_temperature (U300.7), Sense Temperature/FLT2 (J400_FLT2.1)
src_p_T3: sense_temperature (U300.10), Sense Temperature/FLT3 (J400_FLT3.1)
src_p_T4: sense_temperature (U300.15), Sense Temperature/FLT4 (J400_FLT4.1)
src_p_T5: sense_temperature (U300.18), Sense Temperature/FLT5 (J400_FLT5.1)
valve: microcontroller (U600.34), machine_io (Q802.G R810.1)
var1: microcontroller (U600.9), mcu_io (R709.2)
var2: microcontroller (U600.10), mcu_io (R710.2)
var3: microcontroller (U600.11), mcu_io (R711.2)
zc: power_supply (D201.5 R203.1 TP206.1), microcontroller (U600.43)